# Altium schematic sheet LO.SchDoc: DDS
size A4; Organization: Altium Limited; Address1: L3, 12a Rodborough Rd; Address2: Frenchs Forest; Address3: NSW; Address4: Australia 2086
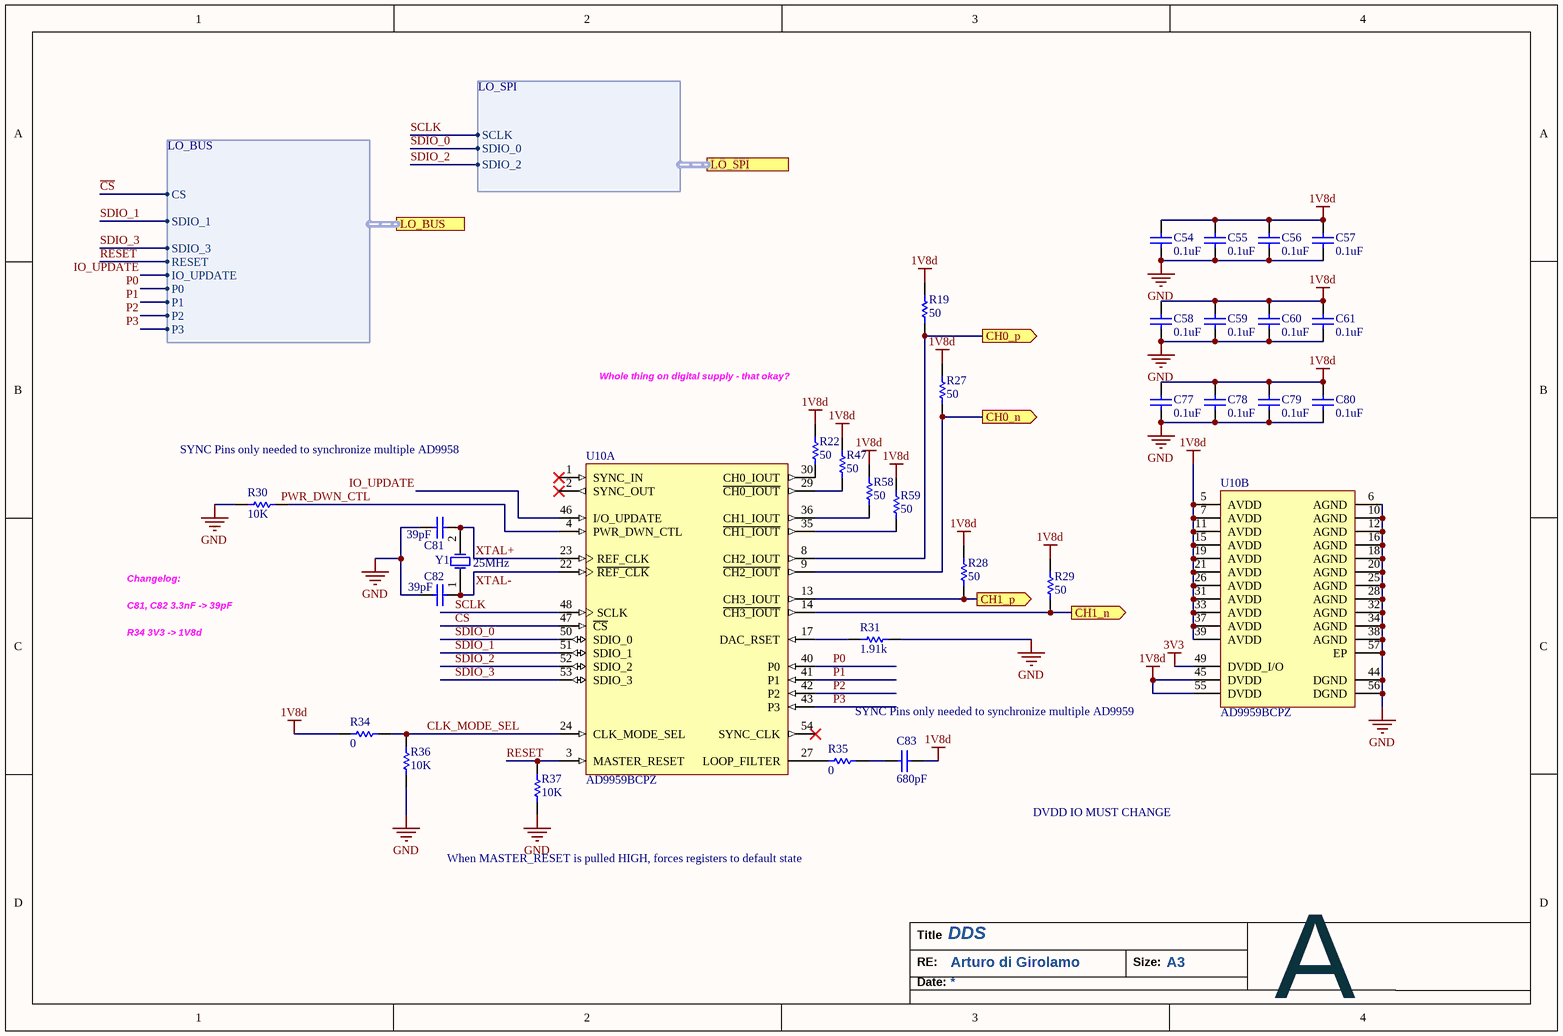
[diagram p0: LO.SchDoc]

## Parts
C54  0.1uF  [0402_Cap]
C55  0.1uF  [0402_Cap]
C56  0.1uF  [0402_Cap]
C57  0.1uF  [0402_Cap]
C58  0.1uF  [0402_Cap]
C59  0.1uF  [0402_Cap]
C60  0.1uF  [0402_Cap]
C61  0.1uF  [0402_Cap]
C77  0.1uF  [0402_Cap]
C78  0.1uF  [0402_Cap]
C79  0.1uF  [0402_Cap]
C80  0.1uF  [0402_Cap]
C81  39pF  [0402_Cap]
C82  39pF  [0402_Cap]
C83  680pF  [0402_Cap]
R19  50  [0402_Res]
R22  50  [0402_Res]
R27  50  [0402_Res]
R28  50  [0402_Res]
R29  50  [0402_Res]
R30  10K  [0402_Res]
R31  1.91k  [0402_Res]
R34  0  [0402_Res]
R35  0  [0402_Res]
R36  10K  [0402_Res]
R37  10K  [0402_Res]
R47  50  [0402_Res]
R58  50  [0402_Res]
R59  50  [0402_Res]
U10  AD9959BCPZ  [ADI-CP-56-1_M]  (parts A,B of 2)
Y1  25MHz  [XTAL_ECS-160-20-4X]

## Ports
CH0_n (out), CH0_p (out), CH1_n (out), CH1_p (out), LO_BUS (harness LO_BUS), LO_SPI (harness LO_SPI)

## Harnesses
LO_BUS: P2, P1, P0, IO_UPDATE, RESET, SDIO_3, SDIO_1, CS, P3
LO_SPI: SDIO_2, SDIO_0, SCLK

## Nets
1V8d: C54.2 C55.2 C56.2 C57.2 C58.2 C59.2 C60.2 C61.2 C77.2 C78.2 C79.2 C80.2 C83.2 R19.2 R22.2 R27.2 R28.2 R29.2 R34.1 R47.2 R58.2 R59.2 U10.5(AVDD) U10.7(AVDD) U10.11(AVDD) U10.15(AVDD) U10.19(AVDD) U10.21(AVDD) U10.26(AVDD) U10.31(AVDD) U10.33(AVDD) U10.37(AVDD) U10.39(AVDD) U10.45(DVDD) U10.55(DVDD)
3V3: U10.49(DVDD_I/O)
GND: C54.1 C55.1 C56.1 C57.1 C58.1 C59.1 C60.1 C61.1 C77.1 C78.1 C79.1 C80.1 C81.2 C82.2 R30.1 R31.2 R36.1 R37.1 U10.6(AGND) U10.10(AGND) U10.12(AGND) U10.16(AGND) U10.18(AGND) U10.20(AGND) U10.25(AGND) U10.28(AGND) U10.32(AGND) U10.34(AGND) U10.38(AGND) U10.44(DGND) U10.56(DGND) U10.57(EP)
~{CS}: U10.47(~{CS}) ; port LO_BUS.CS
CH0_n: R27.1 U10.9(~{CH2_IOUT}) ; port CH0_n
CH0_p: R19.1 U10.8(CH2_IOUT) ; port CH0_p
CH1_n: R29.1 U10.14(~{CH3_IOUT}) ; port CH1_n
CH1_p: R28.1 U10.13(CH3_IOUT) ; port CH1_p
CLK_MODE_SEL: R34.2 R36.2 U10.24(CLK_MODE_SEL)
IO_UPDATE: U10.46(I/O_UPDATE) ; port LO_BUS.IO_UPDATE
P0: U10.40(P0) ; port LO_BUS.P0
P1: U10.41(P1) ; port LO_BUS.P1
P2: U10.42(P2) ; port LO_BUS.P2
P3: U10.43(P3) ; port LO_BUS.P3
RESET: R37.2 U10.3(MASTER_RESET) ; port LO_BUS.RESET
SCLK: U10.48(SCLK) ; port LO_SPI.SCLK
SDIO_0: U10.50(SDIO_0) ; port LO_SPI.SDIO_0
SDIO_1: U10.51(SDIO_1) ; port LO_BUS.SDIO_1
SDIO_2: U10.52(SDIO_2) ; port LO_SPI.SDIO_2
SDIO_3: U10.53(SDIO_3) ; port LO_BUS.SDIO_3
XTAL+: C81.1 U10.23(REF_CLK) Y1.2(OSC2)
XTAL-: C82.1 U10.22(~{REF_CLK}) Y1.1(OSC1)
NetC83_1: C83.1 R35.2
NetR22_1: R22.1 U10.30(CH0_IOUT)
NetR30_2: R30.2 U10.4(PWR_DWN_CTL)
NetR31_1: R31.1 U10.17(DAC_RSET)
NetR35_1: R35.1 U10.27(LOOP_FILTER)
NetR47_1: R47.1 U10.29(~{CH0_IOUT})
NetR58_1: R58.1 U10.36(CH1_IOUT)
NetR59_1: R59.1 U10.35(~{CH1_IOUT})

Not connected (* = marked no-connect by the designer): U10 1(SYNC_IN)* 2(SYNC_OUT)* 54(SYNC_CLK)*

## Notes on the sheet
- Whole thing on digital supply - that okay?
- SYNC Pins only needed to synchronize multiple AD9958
- Changelog:
- C81, C82 3.3nF -> 39pF
- R34 3V3 -> 1V8d
- SYNC Pins only needed to synchronize multiple AD9959
- DVDD IO MUST CHANGE
- (near R37) When MASTER_RESET is pulled HIGH, forces registers to default state
- Labels drawn without touching a wire or pin: PWR_DWN_CTL
- Title
- Date:
- RE:
- Arturo di Girolamo
- Size:
- A3
- A

## Library data of the parts
C54-C61 C77-C80 = CL21B104KACNNNC: Capacitor, 0.1uF, 0805; Value: .01uf; ASYPN: 0402YC104KAT2A; MFGPN: CL21B104KACNNNC
C81 C82 = C0805C332KARACAUTO: Capacitor, 3.3nF, 0805; Value: .01uf; ASYPN: GRM1557U1A332JA01D; MFGPN: C0805C332KARACAUTO
C83 = GRM21BR61E226ME44L: Capacitor, 22uF, 0805, 25V; Value: .01uf; ASYPN: 885012205005; MFGPN: GRM21BR61E226ME44L
R19 R22 R27-R29 R47 R58 R59 = RMCF0805ZT0R00: 0 ohm jumper; Value: 0; ASYPN: FC0402E50R0BTBT1; MFGPN: RMCF0805ZT0R00
R30 R36 R37 = RNCP0805FTD10K0: 10K 1% 1/4W; Value: 1K; ASYPN: MCS0402MC1002FE000; MFGPN: RNCP0805FTD10K0
R31 = RMCF0805ZT0R00: 0 ohm jumper; Value: 0; ASYPN: RMCF0402FT1K91; MFGPN: RMCF0805ZT0R00
R34 R35 = RMCF0805ZT0R00: 0 ohm jumper; ASYPN: RK73Z1ELTP; Value: 0; MFGPN: RMCF0805ZT0R00
U10 = CMP-0293-00014-1: 4-Channel, 500 MSPS DDS with 10-Bit DACs, Serial, CP-56-1, 260 Tray, Pb-Free; Tuning Word Width (bits): 32bit; Master fclk: 500MHz; Compliance Range (V): 2.3V; FS Iout (mA nom): 10mA; REFCLK Multiplier: Yes; I Supply total (max): 180mA; Resolution (Bits): 10bit; ComponentLink3URL: http://www.analog.com/static/imported-files/packages/32698137492825CP_56_1.pdf; PackageDescription: 56-Lead Lead Frame Chip Scale Package [LFCSP_VQ]; DatasheetVersion: Rev. B; ComponentLink1URL: www.analog.com; PackageVersion: 112805-0; ComponentLink1Description: Manufacturer URL; ComponentLink2Description: Datasheet; Code_JEDEC: MO-220-VLLD-2; ComponentLink2URL: http://www.analog.com/static/imported-files/data_sheets/AD9959.pdf; PackageReference: CP-56-1; I/O Interface: Serial; ComponentLink3Description: Package Specification
Y1 = XTAL: Crystal Oscillator; Published: 8-Jun-2000; LatestRevisionDate: 17-Jul-2002; LatestRevisionNote: Re-released for DXP Platform.; PackageReference: R38; Publisher: Altium Limited; PackageDescription: Crystal, Thru-Hole; 2 Leads; Body 3.1 x 8.2 mm (Dia.xH)